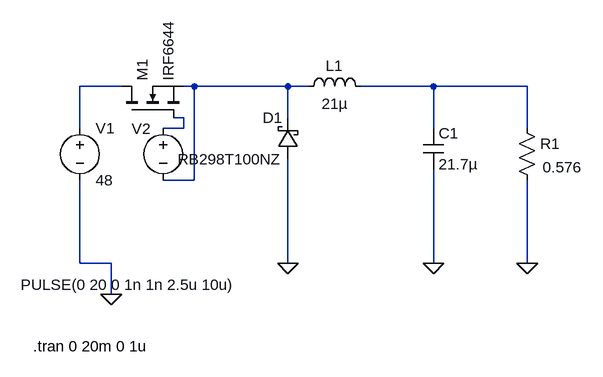
[diagram p0: schematic @buckfinal.asc]
@buckfinal.asc, the LTspice schematic file:
Version 4
SHEET 1 880 680
WIRE -80 48 -144 48
WIRE 32 48 16 48
WIRE 176 48 32 48
WIRE 208 48 176 48
WIRE 400 48 288 48
WIRE 544 48 400 48
WIRE 16 96 0 96
WIRE 176 96 176 48
WIRE -144 112 -144 48
WIRE 16 112 16 96
WIRE 16 112 -16 112
WIRE 400 112 400 48
WIRE 544 112 544 48
WIRE 32 192 32 48
WIRE 32 192 -16 192
WIRE -144 320 -144 192
WIRE -96 320 -144 320
WIRE 176 320 176 160
WIRE 400 320 400 176
WIRE 544 320 544 192
WIRE -96 368 -96 320
FLAG -96 368 0
FLAG 176 320 0
FLAG 400 320 0
FLAG 544 320 0
DATAFLAG 544 64 ""
DATAFLAG 544 48 ""
DATAFLAG 544 96 ""
DATAFLAG 544 96 ""
SYMBOL cap 384 112 R0
SYMATTR InstName C1
SYMATTR Value 21.7µ
SYMATTR SpiceLine Rser=0
SYMBOL ind 192 64 R270
WINDOW 0 32 56 VTop 2
WINDOW 3 5 56 VBottom 2
SYMATTR InstName L1
SYMATTR Value 21µ
SYMATTR SpiceLine Rser=0
SYMBOL res 528 96 R0
WINDOW 3 40 76 Left 2
SYMATTR Value 0.576
SYMATTR InstName R1
SYMBOL voltage -144 96 R0
WINDOW 123 0 0 Left 0
WINDOW 39 0 0 Left 0
SYMATTR InstName V1
SYMATTR Value 48
SYMBOL nmos -80 96 R270
SYMATTR InstName M1
SYMATTR Value IRF6644
SYMBOL voltage -16 96 R0
WINDOW 123 0 0 Left 0
WINDOW 39 0 0 Left 0
WINDOW 0 -48 17 Left 2
WINDOW 3 -219 257 Left 2
SYMATTR InstName V2
SYMATTR Value PULSE(0 20 0 1n 1n 2.5u 10u)
SYMBOL schottky 192 160 R180
WINDOW 0 24 64 Left 2
WINDOW 3 24 0 Left 2
SYMATTR InstName D1
SYMATTR Value RB298T100NZ
SYMATTR Description Diode
SYMATTR Type diode
TEXT -216 448 Left 2 !.tran 0 20m 0 1u

The netlist it stands for:
* @buckfinal.asc
C1 N003 0 21.7µ Rser=0
L1 N002 N003 21µ Rser=0
R1 N003 0 0.576
V1 N001 0 48
M1 N001 N004 N002 N002 IRF6644
V2 N004 N002 PULSE(0 20 0 1n 1n 2.5u 10u)
D1 0 N002 RB298T100NZ
.model D D
.lib standard.dio
.model NMOS NMOS
.model PMOS PMOS
.lib standard.mos
.tran 0 20m 0 1u
.backanno
.end